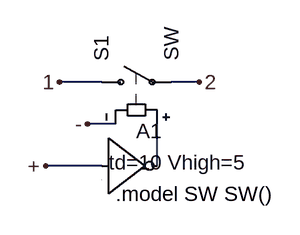
[diagram p0: schematic SPST-NC.asc]
SPST-NC.asc, the LTspice schematic file:
Version 4
SHEET 1 880 680
WIRE 176 144 128 144
WIRE 288 144 256 144
WIRE 192 192 160 192
WIRE 176 240 112 240
WIRE 240 240 240 192
FLAG 112 240 +
FLAG 160 192 -
FLAG 128 144 1
FLAG 288 144 2
SYMBOL sw 160 144 R270
SYMATTR InstName S1
SYMBOL Digital\\inv 176 176 R0
WINDOW 3 8 60 Left 2
SYMATTR Value td=10 Vhigh=5
SYMATTR InstName A1
TEXT 192 272 Left 2 !.model SW SW()

The netlist it stands for:
* SPST-NC.asc
S1 1 2 N001 - SW
A1 + 0 0 0 0 N001 0 0 BUF td=10 Vhigh=5
.model SW SW()
.backanno
.end